# EAGLE schematic arduino-minimul-atmega328p (EAGLE 8.3.1)
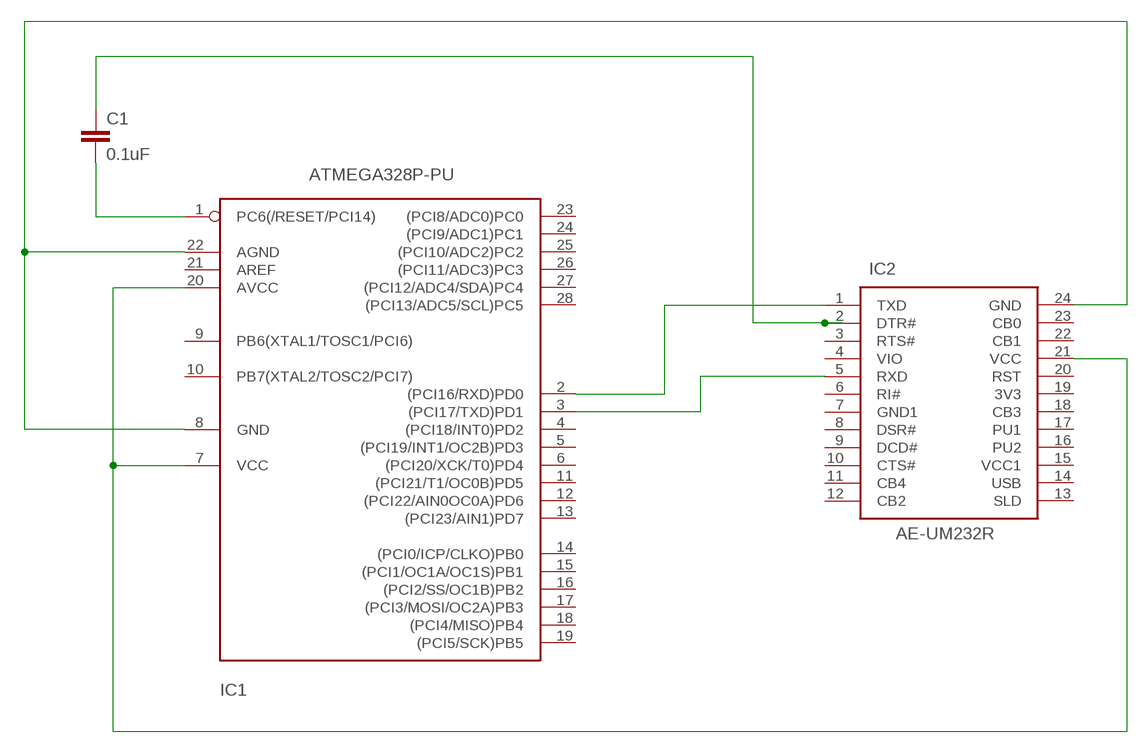
[diagram p0: schematic, sheet 1]

## Parts
C1  0.1uF  C-EU025-024X044  [C025-024X044]
IC1  ATMEGA328P-PU  [DIL28-3]
IC2  AE-UM232R  [AE-UM232R]

## Nets
N$1: IC1.2((PCI16/RXD)PD0) IC2.1(TXD)
N$2: IC1.3((PCI17/TXD)PD1) IC2.5(RXD)
N$3: C1.1 IC2.2(DTR#)
N$4: C1.2 IC1.1(PC6(/RESET/PCI14))
N$5: IC1.7(VCC) IC1.20(AVCC) IC2.21(VCC)
N$6: IC1.8(GND) IC1.22(AGND) IC2.24(GND)
Unconnected: IC1.4((PCI18/INT0)PD2) IC1.5((PCI19/INT1/OC2B)PD3) IC1.6((PCI20/XCK/T0)PD4) IC1.9(PB6(XTAL1/TOSC1/PCI6)) IC1.10(PB7(XTAL2/TOSC2/PCI7)) IC1.11((PCI21/T1/OC0B)PD5) IC1.12((PCI22/AIN0OC0A)PD6) IC1.13((PCI23/AIN1)PD7) IC1.14((PCI0/ICP/CLKO)PB0) IC1.15((PCI1/OC1A/OC1S)PB1) IC1.16((PCI2/SS/OC1B)PB2) IC1.17((PCI3/MOSI/OC2A)PB3) IC1.18((PCI4/MISO)PB4) IC1.19((PCI5/SCK)PB5) IC1.21(AREF) IC1.23((PCI8/ADC0)PC0) IC1.24((PCI9/ADC1)PC1) IC1.25((PCI10/ADC2)PC2) IC1.26((PCI11/ADC3)PC3) IC1.27((PCI12/ADC4/SDA)PC4) IC1.28((PCI13/ADC5/SCL)PC5) IC2.3(RTS#) IC2.4(VIO) IC2.6(RI#) IC2.8(DSR#) IC2.9(DCD#) IC2.10(CTS#) IC2.11(CB4) IC2.12(CB2) IC2.13(SLD) IC2.14(USB) IC2.16(PU2) IC2.17(PU1) IC2.18(CB3) IC2.19(3V3) IC2.20(RST) IC2.22(CB1) IC2.23(CB0)

## Power pins joined to a net without a drawn wire
GND1: IC2.7(GND1)
VCC1: IC2.15(VCC1)

## Library data of the parts
C1 = rcl:C-EU: CAPACITOR, European symbol
IC1 = avr:ATMEGA328P
IC2 = AE-UM232R:AE-UM232R: FT232RL USB-Serial Converter - AE-UM232R